# Altium schematic sheet main.SchDoc
size A4
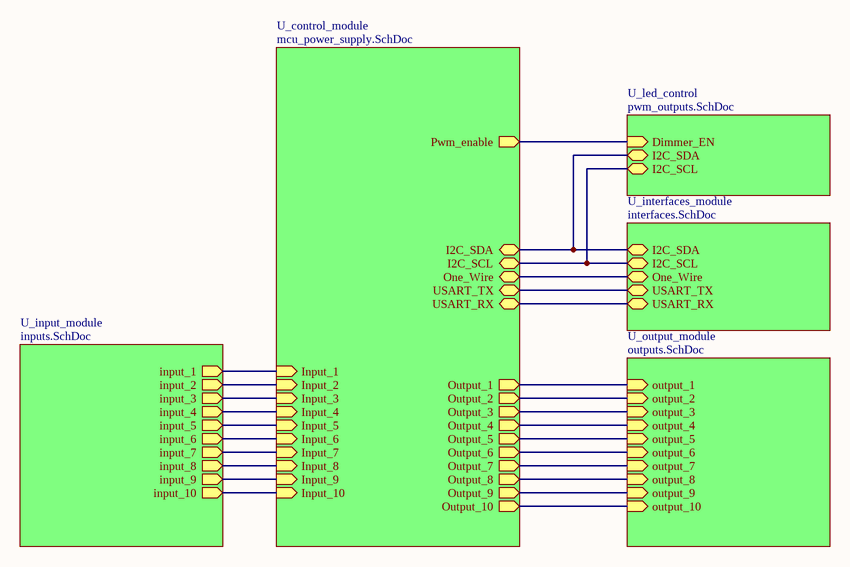
[diagram p0: main.SchDoc]

## Sub-sheets
U_control_module = mcu_power_supply.SchDoc: I2C_SDA (bidir), USART_RX (bidir), USART_TX (bidir), I2C_SCL (bidir), One_Wire (bidir), Input_4 (in), Input_5 (in), Input_1 (in), Input_2 (in), Input_6 (in), Input_3 (in), Output_6 (out), Output_2 (out), Output_4 (out), Output_5 (out), Output_1 (out), Output_3 (out), Input_8 (in), Input_9 (in), Input_7 (in), Input_10 (in), Output_9 (out), Output_10 (out), Output_8 (out), Output_7 (out), Pwm_enable (out)
U_input_module = inputs.SchDoc: input_1 (out), input_2 (out), input_3 (out), input_4 (out), input_5 (out), input_6 (out), input_9 (out), input_10 (out), input_7 (out), input_8 (out)
U_interfaces_module = interfaces.SchDoc: I2C_SDA (bidir), I2C_SCL (bidir), One_Wire (bidir), USART_TX (bidir), USART_RX (bidir)
U_led_control = pwm_outputs.SchDoc: I2C_SDA (bidir), I2C_SCL (bidir), Dimmer_EN (in)
U_output_module = outputs.SchDoc: output_3 (in), output_4 (in), output_2 (in), output_5 (in), output_1 (in), output_6 (in), output_7 (in), output_8 (in), output_9 (in), output_10 (in)

## Nets
(unnamed): sheet U_control_module/I2C_SDA, sheet U_interfaces_module/I2C_SDA, sheet U_led_control/I2C_SDA
(unnamed): sheet U_control_module/USART_RX, sheet U_interfaces_module/USART_RX
(unnamed): sheet U_control_module/USART_TX, sheet U_interfaces_module/USART_TX
(unnamed): sheet U_control_module/I2C_SCL, sheet U_interfaces_module/I2C_SCL, sheet U_led_control/I2C_SCL
(unnamed): sheet U_control_module/One_Wire, sheet U_interfaces_module/One_Wire
(unnamed): sheet U_control_module/Input_4, sheet U_input_module/input_4
(unnamed): sheet U_control_module/Input_5, sheet U_input_module/input_5
(unnamed): sheet U_control_module/Input_1, sheet U_input_module/input_1
(unnamed): sheet U_control_module/Input_2, sheet U_input_module/input_2
(unnamed): sheet U_control_module/Input_6, sheet U_input_module/input_6
(unnamed): sheet U_control_module/Input_3, sheet U_input_module/input_3
(unnamed): sheet U_control_module/Output_6, sheet U_output_module/output_6
(unnamed): sheet U_control_module/Output_2, sheet U_output_module/output_2
(unnamed): sheet U_control_module/Output_4, sheet U_output_module/output_4
(unnamed): sheet U_control_module/Output_5, sheet U_output_module/output_5
(unnamed): sheet U_control_module/Output_1, sheet U_output_module/output_1
(unnamed): sheet U_control_module/Output_3, sheet U_output_module/output_3
(unnamed): sheet U_control_module/Input_8, sheet U_input_module/input_8
(unnamed): sheet U_control_module/Input_9, sheet U_input_module/input_9
(unnamed): sheet U_control_module/Input_7, sheet U_input_module/input_7
(unnamed): sheet U_control_module/Input_10, sheet U_input_module/input_10
(unnamed): sheet U_control_module/Output_9, sheet U_output_module/output_9
(unnamed): sheet U_control_module/Output_10, sheet U_output_module/output_10
(unnamed): sheet U_control_module/Output_8, sheet U_output_module/output_8
(unnamed): sheet U_control_module/Output_7, sheet U_output_module/output_7
(unnamed): sheet U_control_module/Pwm_enable, sheet U_led_control/Dimmer_EN